# EAGLE design JoyCoder (EAGLE 9.2.2)
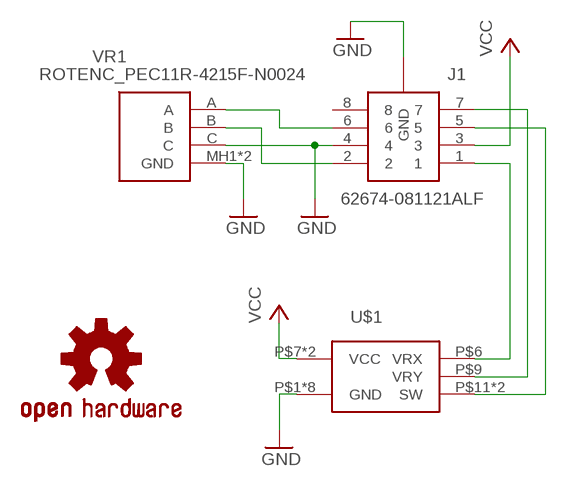
[diagram p0: schematic, sheet 1]

## Parts
J1  62674-081121ALF  [FCI_62674-081121ALF]
LOGO1  OSHW-LOGOS  [OSHW-LOGO-S]
U$1  JOYSTICK  [JOYSTICK_PS2]
VR1  ROTENC_PEC11R-4215F-N0024  [ROTENC_PEC11R-4215F-N0024]

## Nets
GND: J1.4 J1.9(GND) J1.10(GND) J1.11(GND) J1.12(GND) U$1.P$1(GND) U$1.P$2(GND) U$1.P$3(GND) U$1.P$4(GND) U$1.P$5(GND) U$1.P$8(GND) U$1.P$13(GND) U$1.P$14(GND) VR1.C VR1.MH1(GND) VR1.MH2(GND)
N$1: J1.6 VR1.A
N$2: J1.2 VR1.B
N$4: J1.5 U$1.P$11(SW) U$1.P$12(SW)
N$5: J1.7 U$1.P$9(VRY)
N$6: J1.1 U$1.P$6(VRX)
VCC: J1.3 U$1.P$7(VCC) U$1.P$10(VCC)
Unconnected: J1.8

## Library data of the parts
J1 = 62674-081121ALF:62674-081121ALF: CONN FPC/FFC 8POS .5MM VERT SMD Source: Datasheet; DESCRIPTION: CONN FPC/FFC 8POS .5MM VERT SMD; HEIGHT: mm; MANUFACTURER_NAME: FCI; MANUFACTURER_PART_NUMBER: 62674-081121ALF; MOUSER_PART_NUMBER: 649-62674-081121ALF; MOUSER_PRICE-STOCK: https://www.mouser.com/Search/Refine.aspx?Keyword=649-62674-081121ALF; RS_PART_NUMBER: 6734847; RS_PRICE-STOCK: http://uk.rs-online.com/web/p/products/6734847
LOGO1 = SparkFun-Aesthetics:OSHW-LOGO: Open-Source Hardware (OSHW) Logo This logo indicates the piece of hardware it is found on incorporates a OSHW license and/or adheres to the definition of open source hardware found here: http://freedomdefined.org/OSHW
U$1 = pmc_lib:JOYSTICK
VR1 = pmc_lib:ROTENC_PEC11R-4215F-N0024: Bourns 24 Pulse Incremental Mechanical Rotary Encoder with a 6 mm Flat Shaft (Not Indexed), Through Hole Source: Datasheet <https://www.bourns.com/docs/Product-Datasheets/PEC11R.pdf>; ALLIED_NUMBER: 70276555; ALLIED_PRICE-STOCK: https://www.alliedelec.com/bourns-pec11r-4220f-s0024/70276555/; DESCRIPTION: Bourns 24 Pulse Incremental Mechanical Rotary Encoder with a 6 mm Flat Shaft (Not Indexed), Through Hole; HEIGHT: 27.5mm; MANUFACTURER_NAME: Bourns; MANUFACTURER_PART_NUMBER: PEC11R-4220F-S0024; MOUSER_PART_NUMBER: 652-PEC11R-4220F-S24; MOUSER_PRICE-STOCK: https://www.mouser.com/Search/Refine.aspx?Keyword=652-PEC11R-4220F-S24; RS_PART_NUMBER: 1674659; RS_PRICE-STOCK: http://uk.rs-online.com/web/p/products/1674659

## Board
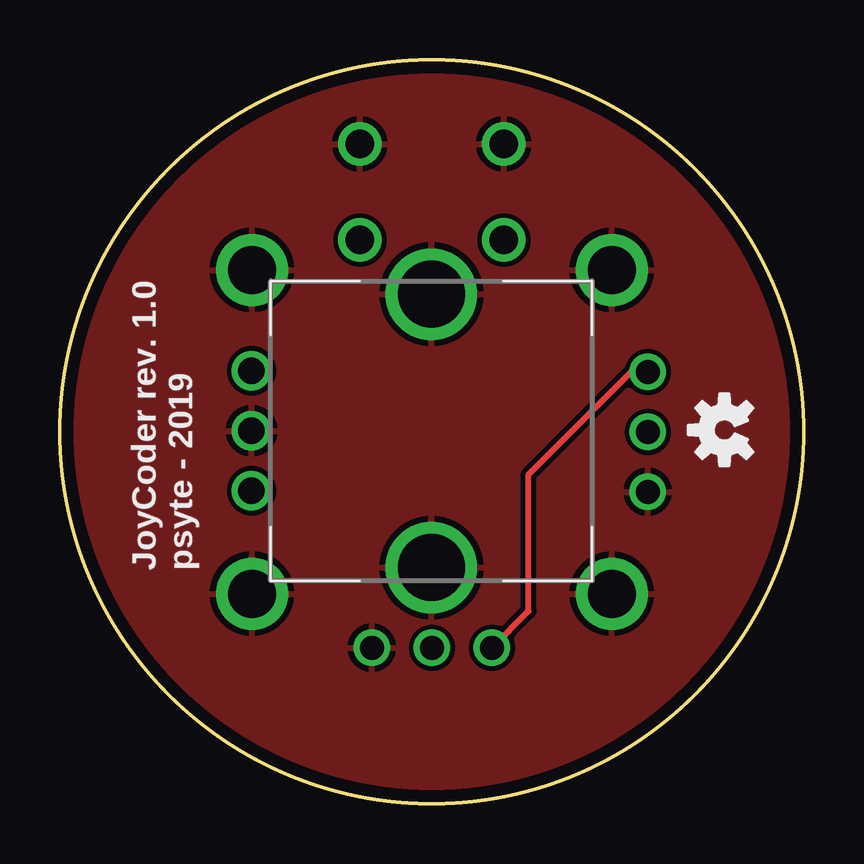
[diagram p1: board, top side]
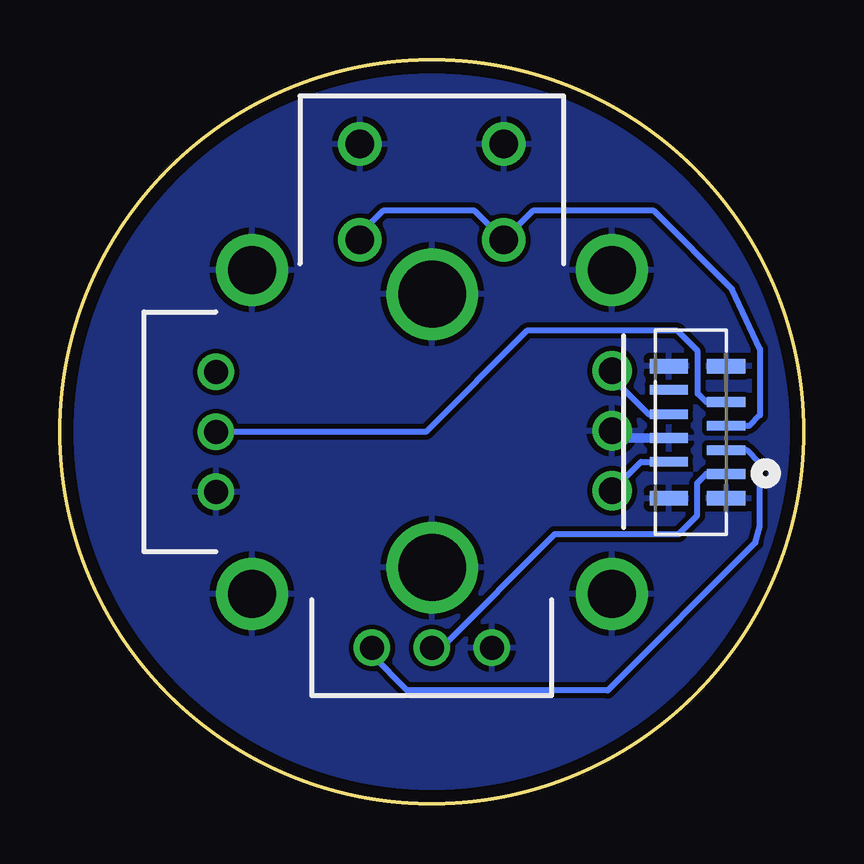
[diagram p2: board, bottom side, seen from below]

Size 31 x 31 mm. Coordinates in mm from the lower left corner, seen from the top.
Outline: circle at 15.5,15.5 radius 15.5
Copper layers (1*16): Top 0.035mm / dielectric 1.5mm / Bottom 0.035mm
Design rules "default *": minimum track width 6mil, minimum drill 0.35mm, track to track 8mil, track to pad 8mil, pad to pad 8mil, via to via 8mil, smd to smd 8mil, copper to edge 20mil, drill to drill 8mil, minimum pad ring 10mil, minimum via ring 8mil, stop-mask expansion 2mil, vias tented up to drill 0mil, thermal gap 10mil

### Footprints (pad centres in the part's own frame; a part is rotated, then mirrored left to right if it is on the bottom)
FCI_62674-081121ALF = smd 0.406 x 1.6: 1 0,4.775; 2 -0.508,2.388; 3 -0.991,4.775; 4 -1.499,2.388; 5 -2.007,4.775; 6 -2.489,2.388; 7 -2.997,4.775; 8 -3.505,2.388 | smd 0.61 x 1.6: 9 -4.496,2.388; 10 1.016,2.388; 11 -4.496,4.775; 12 1.016,4.775
JOYSTICK_PS2 = drill 2 pad 2.54: P$1 7.5,6.75; P$2 -7.5,6.75; P$3 -7.5,-6.75; P$4 7.5,-6.75 | drill 1: P$5 -2.5,9; P$6 0,9; P$7 2.5,9; P$8 9,2.5; P$9 9,0; P$10 9,-2.5 | drill 1.2: P$11 -3,-8; P$12 3,-8; P$13 -3,-12; P$14 3,-12
ROTENC_PEC11R-4215F-N0024 = drill 1.1 pad 1.65: A -2.54,-8.15; B 2.46,-8.15; C -0.04,-8.15 | drill 2.8 pad 3.6: MH1 -5.74,-0.65; MH2 5.66,-0.65

### Placement (x,y rotation side)
J1  8.01,13.74 270 bottom
LOGO1  27.7,15.58 90 top
U$1  15.5,15.5 180 bottom
VR1  16.14,15.5 270 top

### Tracks (layer width: path | path; a pad name or v marks a point on that pad's centre or on a via)
GND
  Bottom 0.254: 7.69,15.24 VR1.C
  Bottom 0.4: J1.4 7.69,15.24
  pour Top: -0.47,31.72 31.53,31.72 31.53,-0.28 -0.47,-0.28
  pour Bottom: -0.47,31.72 31.53,31.72 31.53,-0.28 -0.47,-0.28
N$1
  Bottom 0.254: VR1.A 7.99,17.76 6.46,16.23 J1.6
N$2
  Bottom 0.254: VR1.B 6.78,14.25 J1.2
N$4
  Bottom 0.254: U$1.P$12 18.53,23.53 18.53,23.72 17.53,24.72 13.72,24.72 U$1.P$11 11.28,24.72 6.25,24.72 2.99,21.46 1.82,18.96 1.82,16.2 2.27,15.75 J1.5
N$5
  Bottom 0.254: U$1.P$9 15.75,15.5 11.53,19.72 5.27,19.72 4.41,18.86 4.41,17.1 4.06,16.74 J1.7
N$6
  Bottom 0.254: U$1.P$6 15.11,6.5 10.39,11.22 5.22,11.22 4.44,12.01 4.44,13.37 4.06,13.74 J1.1
VCC
  Top 0.254: U$1.P$7 19.53,8.03 19.53,13.72 23.81,18 U$1.P$10
  Bottom 0.254: U$1.P$7 18,6.19 16.53,4.72 8.17,4.72 2.01,10.88 1.83,11.56 1.83,14.19 2.38,14.74 J1.3

### Text on the board
tPlace: JoyCoder rev. 1.0 / psyte - 2019